# EAGLE design eth-uart (EAGLE 9.6.2)
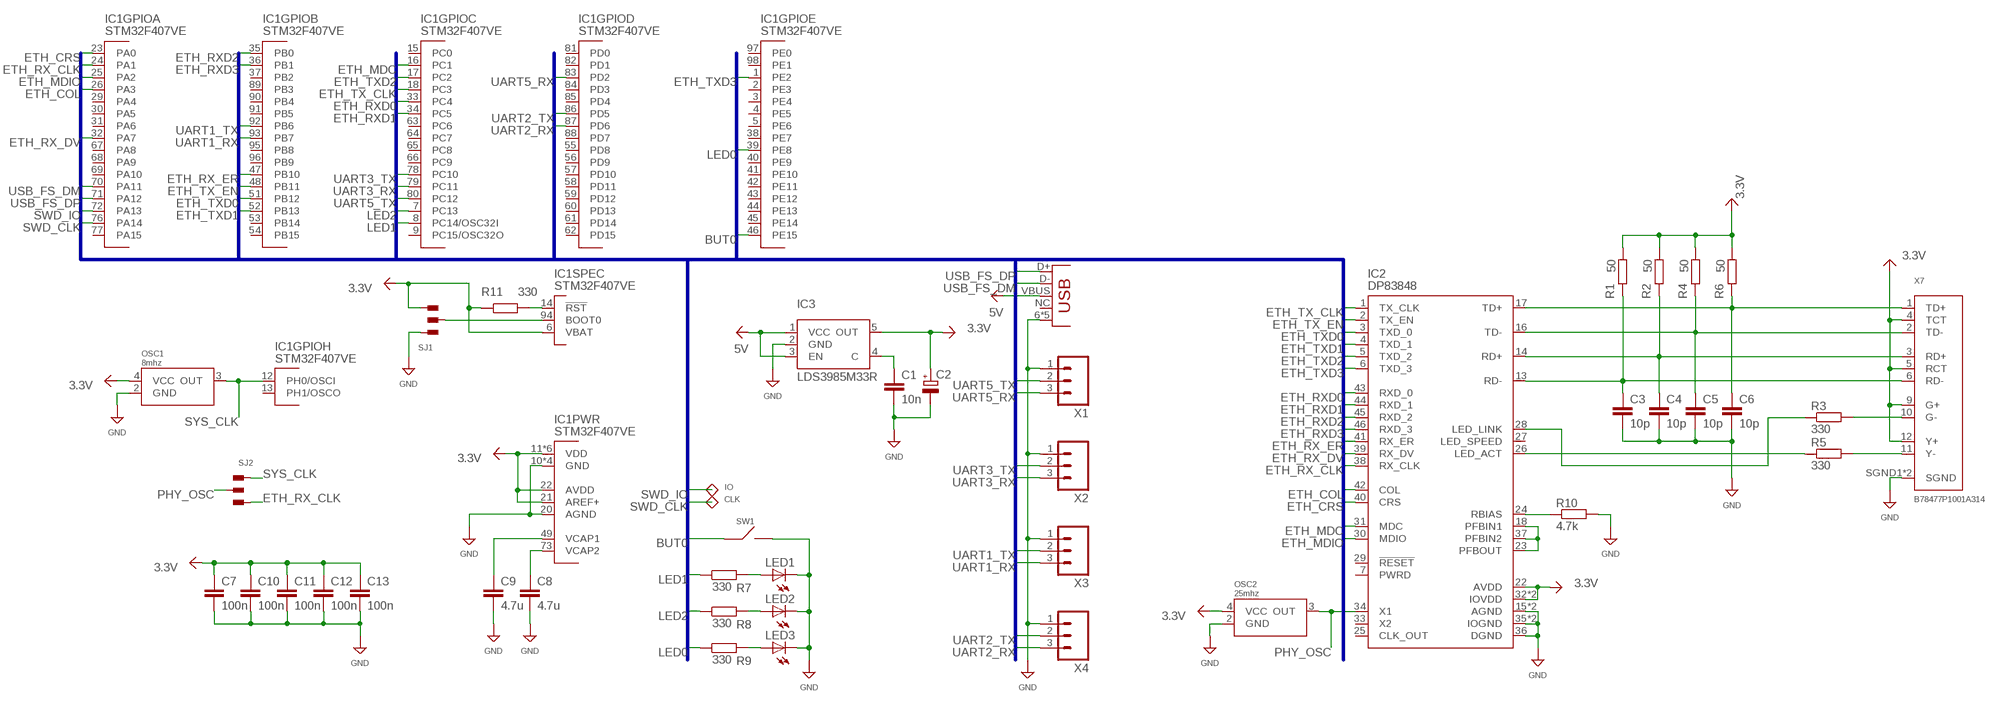
[diagram p0: schematic, sheet 1]

## Parts
C1  10n  CAPC0402  [R0402]
C2  CPOL-EUSMCA  [SMC_A]
C3  10p  CAPC0402  [R0402]
C4  10p  CAPC0402  [R0402]
C5  10p  CAPC0402  [R0402]
C6  10p  CAPC0402  [R0402]
C7  100n  CAPC0402  [R0402]
C8  4.7u  CAPC0603  [R0603]
C9  4.7u  CAPC0603  [R0603]
C10  100n  CAPC0402  [R0402]
C11  100n  CAPC0402  [R0402]
C12  100n  CAPC0402  [R0402]
C13  100n  CAPC0402  [R0402]
IC1  STM32F407VE  [LQFP100]
IC2  DP83848  [LQFP-48]
IC3  LDS3985M33R  LP3985  [SOT23-5]
LED1  LED0603  [LED0603]
LED2  LED0603  [LED0603]
LED3  LED0603  [LED0603]
OSC1  8mhz  OSC3225  [3225]
OSC2  25mhz  OSC3225  [3225]
R1  50  RESR0402  [R0402]
R2  50  RESR0402  [R0402]
R3  330  RESR0402  [R0402]
R4  50  RESR0402  [R0402]
R5  330  RESR0402  [R0402]
R6  50  RESR0402  [R0402]
R7  330  RESR0402  [R0402]
R8  330  RESR0402  [R0402]
R9  330  RESR0402  [R0402]
R10  4.7k  RESR0402  [R0402]
R11  330  RESR0402  [R0402]
SJ1  SJ3  [SJ3]
SJ2  SJ3  [SJ3]
SW1  BUT  [SONY_ERRICSON_SW]
TP1  IO  TP06R  [TP06R]
TP2  CLK  TP06R  [TP06R]
X1  M03  [1X03]
X2  M03  [1X03]
X3  M03  [1X03]
X4  M03  [1X03]
X5  USBMICRO_B  [USB_MICROB]
X7  B78477P1001A314  RJ45-HR11105A  [HR911105A]

## Nets
3.3V: C2.+ C7.1 C10.1 C11.1 C12.1 C13.1 IC1.6(SPEC:VBAT) IC1.11(PWR:VDD) IC1.19(PWR:VDD) IC1.21(PWR:AREF+) IC1.22(PWR:AVDD) IC1.28(PWR:VDD) IC1.50(PWR:VDD) IC1.75(PWR:VDD) IC1.100(PWR:VDD) IC2.22(AVDD) IC2.32(IOVDD) IC2.48(IOVDD) IC3.5(OUT) OSC1.4(VCC) OSC2.4(VCC) R1.1 R2.1 R4.1 R6.1 R11.1 SJ1.3 X7.4(TCT) X7.5(RCT) X7.9(G+) X7.12(Y+)
5V: IC3.1(VCC) IC3.3(EN) X5.VBUS
BOOT0: IC1.94(SPEC:BOOT0) SJ1.2
BUT0: IC1.46(GPIOE:PE15) SW1.1
ETH_COL: IC1.26(GPIOA:PA3) IC2.42(COL)
ETH_CRS: IC1.23(GPIOA:PA0) IC2.40(CRS)
ETH_MDC: IC1.16(GPIOC:PC1) IC2.31(MDC)
ETH_MDIO: IC1.25(GPIOA:PA2) IC2.30(MDIO)
ETH_RX_CLK: IC1.24(GPIOA:PA1) IC2.38(RX_CLK) SJ2.3
ETH_RX_DV: IC1.32(GPIOA:PA7) IC2.39(RX_DV)
ETH_RX_ER: IC1.47(GPIOB:PB10) IC2.41(RX_ER)
ETH_RXD0: IC1.33(GPIOC:PC4) IC2.43(RXD_0)
ETH_RXD1: IC1.34(GPIOC:PC5) IC2.44(RXD_1)
ETH_RXD2: IC1.35(GPIOB:PB0) IC2.45(RXD_2)
ETH_RXD3: IC1.36(GPIOB:PB1) IC2.46(RXD_3)
ETH_TX_CLK: IC1.18(GPIOC:PC3) IC2.1(TX_CLK)
ETH_TX_EN: IC1.48(GPIOB:PB11) IC2.2(TX_EN)
ETH_TXD0: IC1.51(GPIOB:PB12) IC2.3(TXD_0)
ETH_TXD1: IC1.52(GPIOB:PB13) IC2.4(TXD_1)
ETH_TXD2: IC1.17(GPIOC:PC2) IC2.5(TXD_2)
ETH_TXD3: IC1.1(GPIOE:PE2) IC2.6(TXD_3)
GND: C1.2 C2.- C3.2 C4.2 C5.2 C6.2 C7.2 C8.2 C9.2 C10.2 C11.2 C12.2 C13.2 IC1.10(PWR:GND) IC1.20(PWR:AGND) IC1.27(PWR:GND) IC1.74(PWR:GND) IC1.99(PWR:GND) IC2.15(AGND) IC2.19(AGND) IC2.35(IOGND) IC2.36(DGND) IC2.47(IOGND) IC3.2(GND) LED1.C LED2.C LED3.C OSC1.2(GND) OSC2.2(GND) R10.2 SJ1.1 SW1.2 X1.1 X2.1 X3.1 X4.1 X5.6(GND) X5.7(GND) X5.8(GND) X5.9(GND) X5.GND X7.SGND1(SGND) X7.SGND2(SGND)
LED0: IC1.39(GPIOE:PE8) R9.1
LED1: IC1.8(GPIOC:PC14/OSC32I) R7.1
LED2: IC1.7(GPIOC:PC13) R8.1
LED_ACT: IC2.26(LED_ACT) R5.1
LED_G: R3.2 X7.10(G-)
LED_LINK: IC2.28(LED_LINK) R3.1
LED_Y: R5.2 X7.11(Y-)
N$1: IC1.14(SPEC:!RST) R11.2
N$2: IC2.18(PFBIN1) IC2.23(PFBOUT) IC2.37(PFBIN2)
N$5: C1.1 IC3.4(C)
N$6: LED1.A R7.2
N$7: LED2.A R8.2
N$8: LED3.A R9.2
N$9: IC2.24(RBIAS) R10.1
N$13: C8.1 IC1.73(PWR:VCAP2)
N$15: C9.1 IC1.49(PWR:VCAP1)
PHY_OSC: IC2.34(X1) OSC2.3(OUT) SJ2.2
RXDM: C3.1 IC2.13(RD-) R1.2 X7.6(RD-)
RXDP: C4.1 IC2.14(RD+) R2.2 X7.3(RD+)
SWD_CLK: IC1.76(GPIOA:PA14) TP2.TP(TEST)
SWD_IO: IC1.72(GPIOA:PA13) TP1.TP(TEST)
SYS_CLK: IC1.12(GPIOH:PH0/OSCI) OSC1.3(OUT) SJ2.1
TXDM: C5.1 IC2.16(TD-) R4.2 X7.2(TD-)
TXDP: C6.1 IC2.17(TD+) R6.2 X7.1(TD+)
UART1_RX: IC1.93(GPIOB:PB7) X3.3
UART1_TX: IC1.92(GPIOB:PB6) X3.2
UART2_RX: IC1.87(GPIOD:PD6) X4.3
UART2_TX: IC1.86(GPIOD:PD5) X4.2
UART3_RX: IC1.79(GPIOC:PC11) X2.3
UART3_TX: IC1.78(GPIOC:PC10) X2.2
UART5_RX: IC1.83(GPIOD:PD2) X1.3
UART5_TX: IC1.80(GPIOC:PC12) X1.2
USB_FS_DM: IC1.70(GPIOA:PA11) X5.D-
USB_FS_DP: IC1.71(GPIOA:PA12) X5.D+
Unconnected: IC1.2(GPIOE:PE3) IC1.3(GPIOE:PE4) IC1.4(GPIOE:PE5) IC1.5(GPIOE:PE6) IC1.9(GPIOC:PC15/OSC32O) IC1.13(GPIOH:PH1/OSCO) IC1.15(GPIOC:PC0) IC1.29(GPIOA:PA4) IC1.30(GPIOA:PA5) IC1.31(GPIOA:PA6) IC1.37(GPIOB:PB2) IC1.38(GPIOE:PE7) IC1.40(GPIOE:PE9) IC1.41(GPIOE:PE10) IC1.42(GPIOE:PE11) IC1.43(GPIOE:PE12) IC1.44(GPIOE:PE13) IC1.45(GPIOE:PE14) IC1.53(GPIOB:PB14) IC1.54(GPIOB:PB15) IC1.55(GPIOD:PD8) IC1.56(GPIOD:PD9) IC1.57(GPIOD:PD10) IC1.58(GPIOD:PD11) IC1.59(GPIOD:PD12) IC1.60(GPIOD:PD13) IC1.61(GPIOD:PD14) IC1.62(GPIOD:PD15) IC1.63(GPIOC:PC6) IC1.64(GPIOC:PC7) IC1.65(GPIOC:PC8) IC1.66(GPIOC:PC9) IC1.67(GPIOA:PA8) IC1.68(GPIOA:PA9) IC1.69(GPIOA:PA10) IC1.77(GPIOA:PA15) IC1.81(GPIOD:PD0) IC1.82(GPIOD:PD1) IC1.84(GPIOD:PD3) IC1.85(GPIOD:PD4) IC1.88(GPIOD:PD7) IC1.89(GPIOB:PB3) IC1.90(GPIOB:PB4) IC1.91(GPIOB:PB5) IC1.95(GPIOB:PB8) IC1.96(GPIOB:PB9) IC1.97(GPIOE:PE0) IC1.98(GPIOE:PE1) IC2.7(PWRD) IC2.25(CLK_OUT) IC2.27(LED_SPEED) IC2.29(!RESET) IC2.33(X2) X5.NC

## Buses
ETH_TXD[0..3],ETH_MDC,ETH_TX_CLK,ETH_CRS,ETH_RX_CLK,ETH_MDIO,ETH_COL,ETH_RX_DV,ETH_RXD[0..3],ETH_RX_ER,ETH_TX_EN,USB_FS_DP,USB_FS_DM,UART1_TX,UART1_RX,UART2_TX,UART2_RX,UART3_TX,UART3_RX,UART5_TX,UART5_RX,LED[0..2],BUT[0],SWD_IO,SWD_CLK

## Library data of the parts
C1 C3-C13 = netcat:CAP
C2 = netcat:CPOL-EU
IC1 = netcat:STM32F407VE
IC2 = netcat:DP83848
IC3 = netcat:LP3985
LED1-LED3 = netcat:LED: LED OSRAM: - CHIPLED LG R971, LG N971, LY N971, LG Q971, LY Q971, LO R971, LY R971 LH N974, LH R974 LS Q976, LO Q976, LY Q976 LO Q996 - Hyper CHIPLED LW Q18S LB Q993, LB Q99A, LB R99A - SideLED LS A670, LO A670, LY A670, LG A670, LP A670 LB A673, LV A673, LT A673, LW A673 LH A674 LY A675 LS A676, LA A676, LO A676, LY A676, LW A676 LS A679, LY A679, LG A679 - Hyper Micro SIDELED® LS Y876, LA Y876, LO Y876, LY Y876 LT Y87S - SmartLED LW L88C, LW L88S LB L89C, LB L89S, LG L890 LS L89K, LO L89K, LY L89K LS L896, LA L896, LO L896, LY L896 - TOPLED LS T670, LO T670, LY T670, LG T670, LP T670 LSG T670, LSP T670, LSY T670, LOP T670, LYG T670 LG T671, LOG T671, LSG T671 LB T673, LV T673, LT T673, LW T673 LH T674 LS T676, LA T676, LO T676, LY T676, LB T676, LH T676, LSB T676, LW T676 LB T67C, LV T67C, LT T67C, LS T67K, LO T67K, LY T67K, LW E67C LS E67B, LA E67B, LO E67B, LY E67B, LB E67C, LV E67C, LT E67C LW T67C LS T679, LY T679, LG T679 LS T770, LO T770, LY T770, LG T770, LP T770 LB T773, LV T773, LT T773, LW T773 LH T774 LS E675, LA E675, LY E675, LS T675 LS T776, LA T776, LO T776, LY T776, LB T776 LHGB T686 LT T68C, LB T68C - Hyper Mini TOPLED® LB M676 - Mini TOPLED Santana® LG M470 LS M47K, LO M47K, LY M47K Source: http://www.osram.convergy.de LUXEON: - LUMILED® LXK2-PW12-R00, LXK2-PW12-S00, LXK2-PW14-U00, LXK2-PW14-V00 LXK2-PM12-R00, LXK2-PM12-S00, LXK2-PM14-U00 LXK2-PE12-Q00, LXK2-PE12-R00, LXK2-PE12-S00, LXK2-PE14-T00, LXK2-PE14-U00 LXK2-PB12-K00, LXK2-PB12-L00, LXK2-PB12-M00, LXK2-PB14-N00, LXK2-PB14-P00, LXK2-PB14-Q00 LXK2-PR12-L00, LXK2-PR12-M00, LXK2-PR14-Q00, LXK2-PR14-R00 LXK2-PD12-Q00, LXK2-PD12-R00, LXK2-PD12-S00 LXK2-PH12-R00, LXK2-PH12-S00 LXK2-PL12-P00, LXK2-PL12-Q00, LXK2-PL12-R00 Source: www.luxeon.com KINGBRIGHT: KA-3528ASYC Source: www.kingbright.com
OSC1 OSC2 = netcat:OSC
R1-R11 = netcat:RES
SJ1 SJ2 = netcat:SJ3
SW1 = netcat:BUT
TP1 TP2 = netcat:TP
X1-X4 = netcat:M03: Header 3 Standard 3-pin 0.1" header. Use with straight break away headers (SKU : PRT-00116), right angle break away headers (PRT-00553), swiss pins (PRT-00743), machine pins (PRT-00117), and female headers (PRT-00115). Molex polarized connector foot print use with SKU : PRT-08232 with associated crimp pins and housings.
X5 = netcat:USB: USB Connectors USB-B-PTH is fully proven SKU : PRT-00139 USB-miniB is fully proven SKU : PRT-00587 USB-A-PCB is untested. USB-A-H is throughly reviewed, but untested. Spark Fun Electronics SKU : PRT-00437 USB-B-SMT is throughly reviewed, but untested. Needs silkscreen touching up. USB-A-S has not been used/tested USB-MB-H has not been used/tested
X7 = netcat:RJ45

## Board
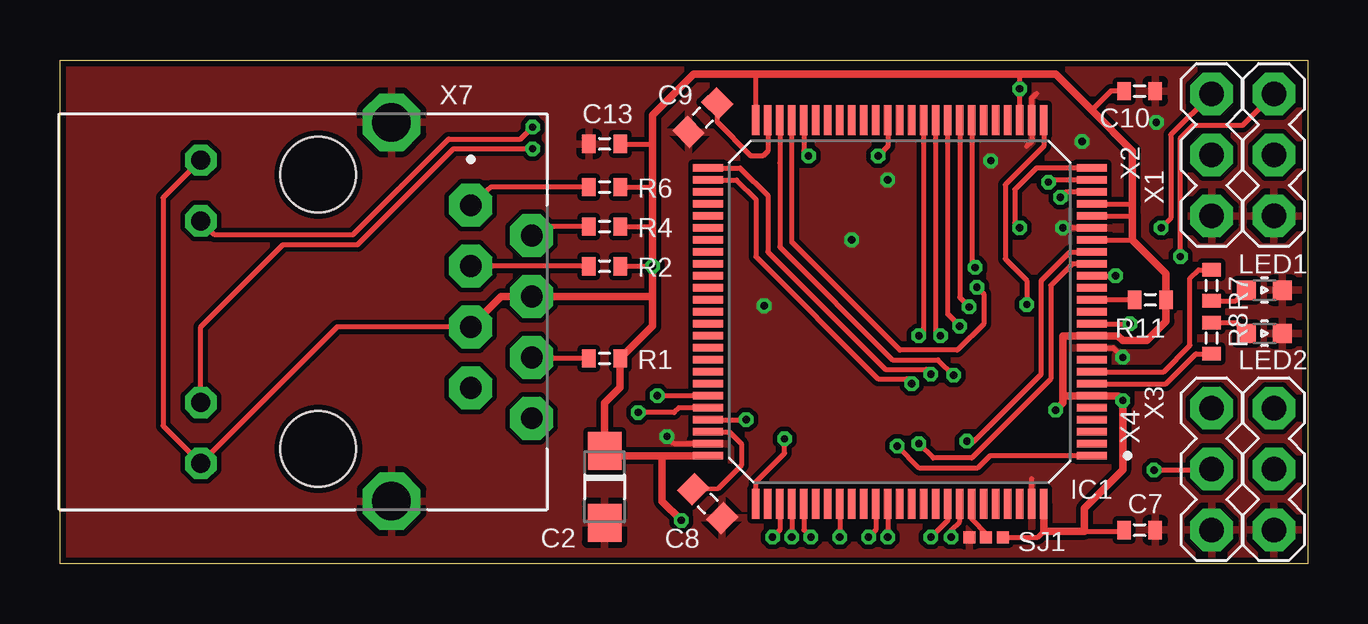
[diagram p1: board, top side]
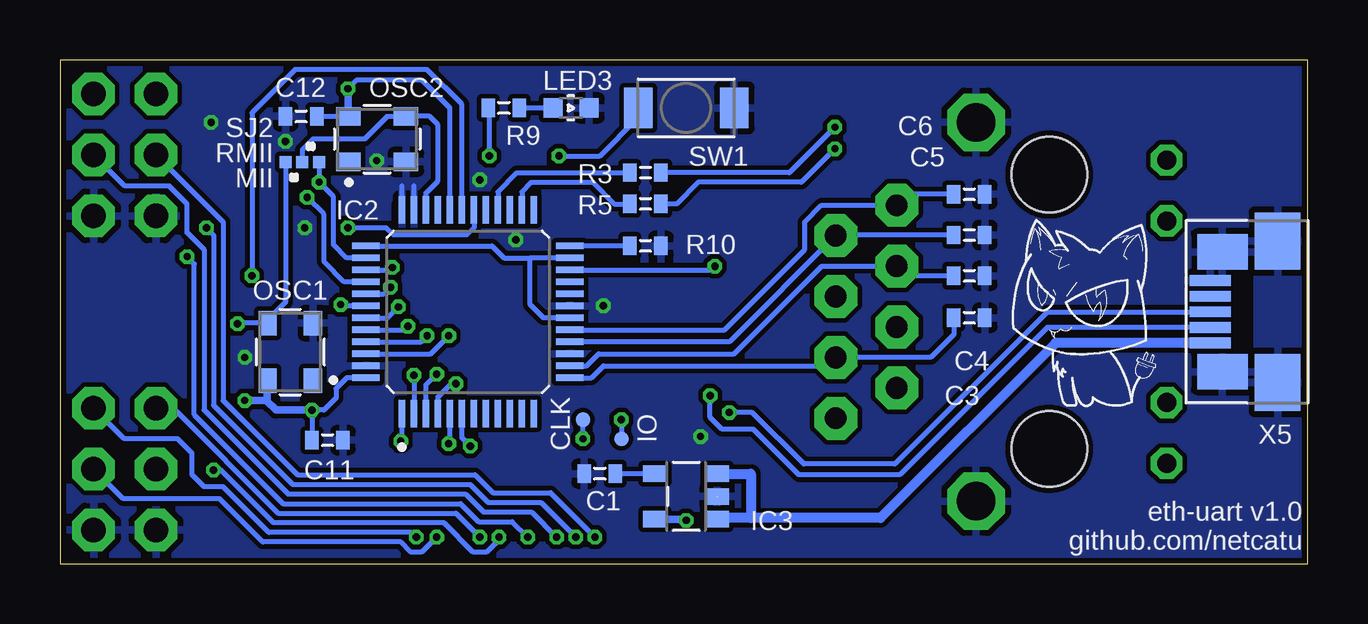
[diagram p2: board, bottom side, seen from below]

Size 52 x 21 mm. Coordinates in mm from the lower left corner, seen from the top.
Outline: 0,21 52,21 52,0 0,0 0,21
Copper layers (1*16): Top 0.035mm / dielectric 1.5mm / Bottom 0.035mm
Design rules "dirt_cheap_dirty_boards.v1": minimum track width 5mil, minimum drill 12mil, track to track 5mil, track to pad 5mil, pad to pad 5mil, via to via 5mil, smd to smd 0mil, copper to edge 10mil, drill to drill 10mil, minimum pad ring 10mil, minimum via ring 6mil, stop-mask expansion 2mil, vias tented up to drill 25mil, thermal gap 10mil
bRestrict: area 37.4,14.5 to 37.5,15; area 37.9,14.5 to 38,15

### Footprints (pad centres in the part's own frame; a part is rotated, then mirrored left to right if it is on the bottom)
R0402 = smd 0.559 x 0.762: 1 -0.65,0; 2 0.65,0
SMC_A = smd 1.6 x 1.4: + -1.5,0; - 1.5,0
R0603 = smd 0.889 x 1.016: 1 -0.85,0; 2 0.85,0
LQFP100 = smd 0.3 x 1.25: 1 -6,-8; 2 -5.5,-8; 3 -5,-8; 4 -4.5,-8; 5 -4,-8; 6 -3.5,-8; 7 -3,-8; 8 -2.5,-8; 9 -2,-8; 10 -1.5,-8; 11 -1,-8; 12 -0.5,-8; 13 0,-8; 14 0.5,-8; 15 1,-8; 16 1.5,-8; 17 2,-8; 18 2.5,-8; 19 3,-8; 20 3.5,-8; 21 4,-8; 22 4.5,-8; 23 5,-8; 24 5.5,-8; 25 6,-8; 51 6,8; 52 5.5,8; 53 5,8; 54 4.5,8; 55 4,8; 56 3.5,8; 57 3,8; 58 2.5,8; 59 2,8; 60 1.5,8; 61 1,8; 62 0.5,8; 63 0,8; 64 -0.5,8; 65 -1,8; 66 -1.5,8; 67 -2,8; 68 -2.5,8; 69 -3,8; 70 -3.5,8; 71 -4,8; 72 -4.5,8; 73 -5,8; 74 -5.5,8; 75 -6,8 | smd 1.25 x 0.3: 26 8,-6; 27 8,-5.5; 28 8,-5; 29 8,-4.5; 30 8,-4; 31 8,-3.5; 32 8,-3; 33 8,-2.5; 34 8,-2; 35 8,-1.5; 36 8,-1; 37 8,-0.5; 38 8,0; 39 8,0.5; 40 8,1; 41 8,1.5; 42 8,2; 43 8,2.5; 44 8,3; 45 8,3.5; 46 8,4; 47 8,4.5; 48 8,5; 49 8,5.5; 50 8,6; 76 -8,6; 77 -8,5.5; 78 -8,5; 79 -8,4.5; 80 -8,4; 81 -8,3.5; 82 -8,3; 83 -8,2.5; 84 -8,2; 85 -8,1.5; 86 -8,1; 87 -8,0.5; 88 -8,0; 89 -8,-0.5; 90 -8,-1; 91 -8,-1.5; 92 -8,-2; 93 -8,-2.5; 94 -8,-3; 95 -8,-3.5; 96 -8,-4; 97 -8,-4.5; 98 -8,-5; 99 -8,-5.5; 100 -8,-6
LQFP-48 = smd 0.254 x 1.143: 1 -2.75,-4.25; 2 -2.25,-4.25; 3 -1.75,-4.25; 4 -1.25,-4.25; 5 -0.75,-4.25; 6 -0.25,-4.25; 7 0.25,-4.25; 8 0.75,-4.25; 9 1.25,-4.25; 10 1.75,-4.25; 11 2.25,-4.25; 12 2.75,-4.25; 25 2.75,4.25; 26 2.25,4.25; 27 1.75,4.25; 28 1.25,4.25; 29 0.75,4.25; 30 0.25,4.25; 31 -0.25,4.25; 32 -0.75,4.25; 33 -1.25,4.25; 34 -1.75,4.25; 35 -2.25,4.25; 36 -2.75,4.25 | smd 1.143 x 0.254: 13 4.25,-2.75; 14 4.25,-2.25; 15 4.25,-1.75; 16 4.25,-1.25; 17 4.25,-0.75; 18 4.25,-0.25; 19 4.25,0.25; 20 4.25,0.75; 21 4.25,1.25; 22 4.25,1.75; 23 4.25,2.25; 24 4.25,2.75; 37 -4.25,2.75; 38 -4.25,2.25; 39 -4.25,1.75; 40 -4.25,1.25; 41 -4.25,0.75; 42 -4.25,0.25; 43 -4.25,-0.25; 44 -4.25,-0.75; 45 -4.25,-1.25; 46 -4.25,-1.75; 47 -4.25,-2.25; 48 -4.25,-2.75
SOT23-5 = smd 0.69 x 0.99: 1 -0.95,-1.29; 2 0,-1.29; 3 0.95,-1.29; 4 0.95,1.3; 5 -0.95,1.3
LED0603 = smd 0.8 x 0.8: A 0,-0.75; C 0,0.75
3225 = smd 1.016 x 0.762: 1 -1.28,-0.948; 2 1.121,-0.948; 3 1.121,0.948; 4 -1.28,0.948
SJ3 = smd 0.5 x 0.5: 1 -0.7,0; 2 0,0; 3 0.7,0
SONY_ERRICSON_SW = smd 1.2 x 1.7: 1 -2,0; 2 2,0
TP06R = smd 0.6 x 0.6: TP 0,0
1X03 = drill 1.016 pad 1.778 octagon: 1 0,0; 2 2.54,0; 3 5.08,0
USB_MICROB = smd 2.1 x 1.475: 6 2.3,-2.5; 8 2.3,2.5 | smd 1.9 x 2.375: 7 0,-2.95; 9 0,2.95 | smd 1.7 x 0.45: D+ 2.8,0; D- 2.8,0.65; GND 2.8,-1.3; NC 2.8,-0.65; VBUS 2.8,1.3
HR911105A = drill 0.9 pad 1.8 octagon: 1 -4.445,7.62; 2 -3.175,10.16; 3 -1.905,7.62; 4 -0.635,10.16; 5 0.635,7.62; 6 1.905,10.16; 7 3.175,7.62; 8 4.445,10.16 | drill 0.8 octagon: 9 -6.325,-3.63; 10 -3.785,-3.63; 11 3.785,-3.63; 12 6.325,-3.63 | drill 1.6 octagon: SGND1 -7.9,4.32; SGND2 7.9,4.32 | hole 3.15: -5.715,1.27; 5.715,1.27

### Placement (x,y rotation side)
C1  29.5,3.75 180 bottom
C2  22.7,3.2 270 top
C3  14.1,10.25 0 bottom
C4  14.1,12 0 bottom
C5  14.1,13.7 0 bottom
C6  14.1,15.4 0 bottom
C7  45,1.4 0 top
C8  27,2.5 315 top
C9  26.8,18.6 225 top
C10  45,19.7 0 top
C11  40.85,5.15 0 bottom
C12  41.95,18.65 180 bottom
C13  22.7,17.5 180 top
IC1  35,10.5 90 top
IC2  35,10.5 0 bottom
IC3  25.9,2.8 90 bottom
LED1  50.2,11.4 270 top
LED2  50.2,9.6 270 top
LED3  30.7,19 270 bottom
OSC1  42.4,8.9 90 bottom
OSC2  38.7,17.7 0 bottom
R1  22.7,8.55 180 top
R2  22.7,12.4 180 top
R3  27.6,16.3 0 bottom
R4  22.7,14.05 180 top
R5  27.6,15 0 bottom
R6  22.7,15.7 180 top
R7  48,11.6 270 top
R8  48,9.4 90 top
R9  33.5,19 0 bottom
R10  27.6,13.25 0 bottom
R11  45.45,11 180 top
SJ1  38.6,1.1 0 top
SJ2  41.9,16.75 0 bottom
SW1  25.9,19 0 bottom
TP1  28.6,5.2 0 bottom
TP2  30.2,6 0 bottom
U$1  [LOGO2]  9.3,10.45 0 bottom
X1  50.6,14.5 90 top
X2  48,14.5 90 top
X3  50.6,1.4 90 top
X4  48,1.4 90 top
X5  1.25,10.5 180 bottom
X7  9.5,10.5 270 top

### Tracks (layer width: path | path; a pad name or v marks a point on that pad's centre or on a via)
3.3V  (via drill 0.3)
  Top 0.2: R6.1 24.7,15.7 | R4.1 24.65,14.05 | R2.1 v24.7,12.4 | IC1.50 29,20.4 | IC1.22 44.7,15 | IC1.28 v40,19.8 40,20.4 | IC1.21 44.7,14.5 | IC1.19 44.7,13.5 | C13.1 24.7,17.5 | C10.1 43.8,19.7 43,18.9 | 42.7,1.35 44.3,1.35 C7.1 | SJ1.3 40.75,1.1 41,1.35 | X7.5 11.56,9.87 X7.12 4.3,5.75 4.3,15.26 X7.9
  Top 0.305: 24.7,14.1 24.7,15.7 24.7,17.5 24.7,18.7 26.4,20.4 29,20.4 40,20.4 41.5,20.4 43,18.9 44.7,17.2 44.7,15 44.7,14.5 44.7,13.5 46.1,12.1 R11.1 46.1,10.1 45.3,9.3 44.3,9.3 44.1,9.5 IC1.11 41.8,9.5 41.8,7 | 24.7,14.1 v24.7,12.4 24.7,11.2 | 24.7,11.2 24.7,9.9 R1.1 23.35,7.35 22.7,6.7 C2.+ 22.7,4.5 25.1,4.5 | 24.65,14.05 24.7,14.1 | 24.7,11.2 24.64,11.13 X7.4 18.39,11.13 X7.5 | IC1.75 25.1,4.5 | v25.9,1.8 25.1,2.6 25.1,4.5 | 41.8,7 41.8,6.7 v41.5,6.4 | IC1.100 41,1.35 42.7,1.35 42.7,2.3 44.3,3.9 v44.3,6.8 44.1,7 IC1.6 41.8,7
  Bottom 0.2: C12.1 OSC2.4 | IC2.32 35.75,19 36.9,20.15 39.65,20.15 v40,19.8 | IC2.22 24.85,12.25 v24.7,12.4 | IC2.48 40.05,7.75 40.5,7.3 40.5,6.9 41,6.4 v41.5,6.4 C11.1
  Bottom 0.305: IC3.5 26.05,1.85 26,1.8 v25.9,1.8 | OSC2.4 40,18.67 v40,19.8 | OSC1.4 43.37,7.6 43.37,6.77 | 43.37,6.77 43,6.4 v41.5,6.4 | v44.3,6.8 43.4,6.8 43.37,6.77
5V
  Bottom 0.406: X5.VBUS 10.5,9.2 17.8,1.9 23.2,1.9 | IC3.1 24.56,1.9 23.2,1.9 | IC3.3 23.2,3.75 23.2,1.9
BOOT0
  Top 0.2: IC1.94 38,1.85 38.6,1.25 SJ1.2
BUT0  (via drill 0.3)
  Top 0.2: IC1.46 31,17.2 v31.2,17
  Bottom 0.2: v31.2,17 29.5,17 27.9,18.6 SW1.1
ETH_COL  (via drill 0.3)
  Top 0.2: IC1.26 41,17.4 39.4,15.8 39.4,12.7 40.3,11.8 v40.3,10.8
  Bottom 0.2: IC2.42 40.25,10.75 v40.3,10.8
ETH_CRS  (via drill 0.3)
  Top 0.2: IC1.23 41.93,15.5 v41.7,15.27
  Bottom 0.2: IC2.40 40.15,11.75 41,12.6 41,14.57 v41.7,15.27
ETH_MDC  (via drill 0.3)
  Top 0.2: IC1.16 v44,12
  Bottom 0.2: IC2.31 35.25,19.15 36.7,20.6 42.2,20.6 44,18.8 v44,12
ETH_MDIO  (via drill 0.3)
  Top 0.2: v40,14 39.8,14.2 39.8,15.6 40.7,16.5 IC1.25
  Bottom 0.2: IC2.30 34.75,14 35.05,13.7 38.1,13.7 38.4,14 v40,14
ETH_RX_CLK  (via drill 0.3)
  Top 0.2: IC1.24 41.3,16 v41.2,15.9
  Bottom 0.2: IC2.38 40.05,12.75 40.6,13.3 40.6,15.3 v41.2,15.9 41.2,16 SJ2.3
ETH_RX_DV  (via drill 0.3)
  Top 0.2: IC1.32 38,12.5 v38.15,12.35
  Bottom 0.2: IC2.39 38.25,12.25 v38.15,12.35
ETH_RX_ER  (via drill 0.3)
  Top 0.2: v38.22,11.52 38.5,11.25 38.5,10 37.4,8.9 35,8.9 30.5,13.4 IC1.47
  Bottom 0.2: IC2.41 38.5,11.25 38.25,11.5 v38.22,11.52
ETH_RXD0  (via drill 0.3)
  Top 0.2: IC1.33 37.5,11.1 v37.9,10.7
  Bottom 0.2: IC2.43 38.35,10.25 v37.9,10.7
ETH_RXD1  (via drill 0.3)
  Top 0.2: v37.5,9.9 37,10.4 IC1.34
  Bottom 0.2: IC2.44 37.65,9.75 v37.5,9.9
ETH_RXD2  (via drill 0.3)
  Top 0.2: v36.7,9.5 36.5,9.7 IC1.35
  Bottom 0.2: IC2.45 36.95,9.25 v36.7,9.5
ETH_RXD3  (via drill 0.3)
  Top 0.2: v35.8,9.5 36,9.7 IC1.36
  Bottom 0.2: IC2.46 36.55,8.75 v35.8,9.5
ETH_TX_CLK  (via drill 0.3)
  Top 0.2: IC1.18 42.1,13 40.9,11.8 40.9,7.9 38.1,5.1 v37.8,5.1
  Bottom 0.2: v37.8,5.1 37.75,5.15 IC2.1
ETH_TX_EN  (via drill 0.3)
  Top 0.2: IC1.48 30,16.7 30,13.2 34.7,8.5 36.6,8.5 v37.25,7.85 v37.25,7.86
  Bottom 0.2: v37.25,7.86 IC2.2
ETH_TXD0  (via drill 0.3)
  Top 0.2: IC1.51 28.35,16.5 29.5,15.35 29.5,13 34.4,8.1 36.1,8.1 v36.3,7.9
  Bottom 0.2: IC2.3 36.75,7.45 v36.3,7.9
ETH_TXD1  (via drill 0.3)
  Top 0.2: IC1.52 28.2,16 29,15.2 29,12.8 34.1,7.7 35.3,7.7 v35.5,7.5
  Bottom 0.2: IC2.4 36.25,6.95 35.7,7.5 v35.5,7.5
ETH_TXD2  (via drill 0.3)
  Top 0.2: IC1.17 42.2,12.5 41.3,11.6 41.3,7.7 38,4.4 36.4,4.4 v35.8,5
  Bottom 0.2: v35.8,5 35.75,5.05 IC2.5
ETH_TXD3  (via drill 0.3)
  Top 0.2: v34.9,4.9 35.83,3.97 38.23,3.97 38.76,4.5 IC1.1
  Bottom 0.2: IC2.6 35.25,5.25 v34.9,4.9
GND  (via drill 0.3)
  Top 0.2: IC1.20 v41.8,14 | 40.7,19.6 40.5,19.4 IC1.27 40.5,17.6 40.3,17.4 | v25.3,5.3 25.6,5 IC1.74 | IC1.99 40.5,3.55 | IC1.10 43.9,9 v44.3,8.6
  Bottom 0.2: IC2.36 37.75,15.75 | IC2.35 37.25,15.75
  other vias: 38.8,16.8 45.7,18.4 33,13.5 42.6,17.6 34.5,16 29.35,10.75
  pour Top (isolate 0.2): 52,21 0,21 0,0 52,0
  pour Bottom (isolate 0.2): 52,21 0,21 0,0 52,0
LED0  (via drill 0.3)
  Top 0.2: IC1.39 34.5,17.4 v34.1,17
  Bottom 0.2: v34.1,17 34.1,18.95 R9.1
LED1
  Top 0.2: IC1.8 46,8 47.1,9.1 47.1,11.9 47.45,12.25 R7.1
LED2
  Top 0.2: IC1.7 46.1,7.5 47.35,8.75 R8.1
LED_ACT
  Bottom 0.2: IC2.26 32.75,15.5 32.35,15.9 29.8,15.9 28.9,15 R5.1
LED_G  (via drill 0.3)
  Top 0.2: v19.7,18.2 19.2,17.7 16.2,17.7 12.2,13.7 6.46,13.7 X7.10
  Bottom 0.2: v19.7,18.2 21.6,16.3 R3.2
LED_LINK
  Bottom 0.2: IC2.28 33.75,15.5 32.95,16.3 R3.1
LED_Y  (via drill 0.3)
  Top 0.2: X7.11 5.87,9.87 9.3,13.3 12.4,13.3 16.4,17.3 v19.7,17.3
  Bottom 0.2: v19.7,17.3 21.1,15.9 25.4,15.9 26.3,15 R5.2
N$1
  Top 0.2: R11.2 IC1.14
N$2
  Bottom 0.2: IC2.37 34,13.25 33.5,12.75 32.4,12.75 | IC2.23 32.4,12.75 | IC2.18 31.85,10.25 32.4,10.8 32.4,12.75
N$5
  Bottom 0.2: IC3.4 C1.1
N$6
  Top 0.2: R7.2 49,10.95 LED1.A
N$7
  Top 0.2: R8.2 49,10.05 LED2.A
N$8
  Bottom 0.2: LED3.A R9.2
N$9
  Bottom 0.2: R10.1 IC2.24
N$13
  Top 0.2: IC1.73 27.9,5.5 28.4,5 28.4,4.1 27.42,3.12 C8.1
N$15
  Top 0.2: IC1.49 29.5,17.2 29.3,17 28.8,17 27.4,18.4 C9.1
PHY_OSC
  Bottom 0.2: 37.7,18.65 OSC2.3 | OSC2.3 38.35,18.65 39.3,17.7 41.45,17.7 41.9,17.25 SJ2.2 | IC2.34 36.75,15.45 36.25,15.95 36.25,18.3 36.6,18.65 OSC2.3
RXDM
  Top 0.2: R1.2 19.7,8.55 X7.6
  Bottom 0.2: C3.1 14.75,9.55 15.7,8.6 X7.6 20,8.25 29.35,8.25 29.85,7.75 IC2.13
RXDP
  Top 0.2: R2.2 21.75,12.4 X7.3
  Bottom 0.2: C4.1 16.71,12 X7.3 20.25,12.4 23.9,8.75 29.55,8.75 30.05,8.25 IC2.14
SWD_CLK  (via drill 0.3)
  Top 0.2: IC1.76 29,3.4 30.2,4.6 v30.2,5.2
  Bottom 0.2: v30.2,5.2 TP2.TP
SWD_IO  (via drill 0.3)
  Top 0.2: IC1.72 v28.6,6
  Bottom 0.2: v28.6,6 TP1.TP
SYS_CLK  (via drill 0.3)
  Top 0.2: IC1.12 v44.6,10
  Bottom 0.2: v44.6,10 44.58,10.02 OSC1.3 43.35,10.15 42.6,10.9 SJ2.1
TXDM
  Top 0.2: R4.2 20.04,14.05 X7.2
  Bottom 0.2: IC2.16 24.1,9.25 19.68,13.68 X7.2 19.64,13.7 C5.1
TXDP
  Top 0.2: R6.2 17.98,15.7 X7.1
  Bottom 0.2: C6.1 16.66,15.4 X7.1 20.25,14.95 20.95,14.25 20.95,13.1 24.3,9.75 IC2.17
UART1_RX  (via drill 0.3)
  Top 0.2: v37.15,1.1 37.15,1.4 37.5,1.75 IC1.93
  Bottom 0.2: X3.3 49.32,5.2 47.1,5.2 46.5,4.6 46.5,3.7 46,3.2 45.2,3.2 43.3,1.3 37.35,1.3 v37.15,1.1
UART1_TX  (via drill 0.3)
  Top 0.2: IC1.92 37,1.8 v36.3,1.1
  Bottom 0.2: X3.2 49.36,2.7 45.35,2.7 43.55,0.9 37.8,0.9 37.4,0.5 36.9,0.5 v36.3,1.1
UART2_RX  (via drill 0.3)
  Top 0.2: IC1.87 v34.5,1.1
  Bottom 0.2: X4.3 47.28,6.48 42.9,2.1 35.5,2.1 v34.5,1.1
UART2_TX  (via drill 0.3)
  Top 0.2: v33.7,1.1 34,1.4 IC1.86 | v45.6,3.9 47.96,3.9 X4.2
  Bottom 0.2: v33.7,1.1 33.7,1 34.2,0.5 34.8,0.5 36,1.7 43.1,1.7 45.3,3.9 v45.6,3.9
UART3_RX  (via drill 0.3)
  Top 0.2: IC1.79 v30.5,1.1 | X2.3 46.3,17.88 46.3,14.4 v45.9,14
  Bottom 0.2: v45.9,14 45.6,13.7 45.6,6.6 42.3,3.3 34.9,3.3 34.15,2.55 31.95,2.55 v30.5,1.1
UART3_TX  (via drill 0.3)
  Top 0.2: IC1.78 30,1.4 v29.7,1.1
  Bottom 0.2: X2.2 45.2,14.24 45.2,6.8 42.1,3.7 34.7,3.7 33.95,2.95 31.55,2.95 v29.7,1.1
UART5_RX  (via drill 0.3)
  Top 0.2: IC1.83 v32.5,1.1 | X1.3 49.3,18.28 47.23,18.28 46.7,17.75 v46.7,12.8
  Bottom 0.2: v46.7,12.8 46.4,12.5 46.4,6.2 42.7,2.5 35.3,2.5 34.55,1.75 33.15,1.75 v32.5,1.1
UART5_TX  (via drill 0.3)
  Top 0.2: IC1.80 31,1.4 v31.3,1.1
  Bottom 0.2: X1.2 49.3,15.74 47.44,15.74 46.7,15 46.7,13.8 46,13.1 46,6.4 42.5,2.9 35.1,2.9 34.35,2.15 32.35,2.15 v31.3,1.1
USB_FS_DM  (via drill 0.3)
  Top 0.2: IC1.70 v24.9,7
  Bottom 0.2: X5.D- 10.85,9.85 17,3.7 21.2,3.7 23.1,5.6 24.4,5.6 24.9,6.1 v24.9,7
USB_FS_DP  (via drill 0.3)
  Top 0.2: IC1.71 25.8,6.5 25.6,6.3 v24.1,6.3
  Bottom 0.2: X5.D+ 10.85,10.5 17.2,4.15 21,4.15 23.15,6.3 v24.1,6.3

### Text on the board
bPlace: eth-uart v1.0 / github.com/netcatu
bNames: RMII | MII